# Altium schematic sheet USB2517.SchDoc
size A3
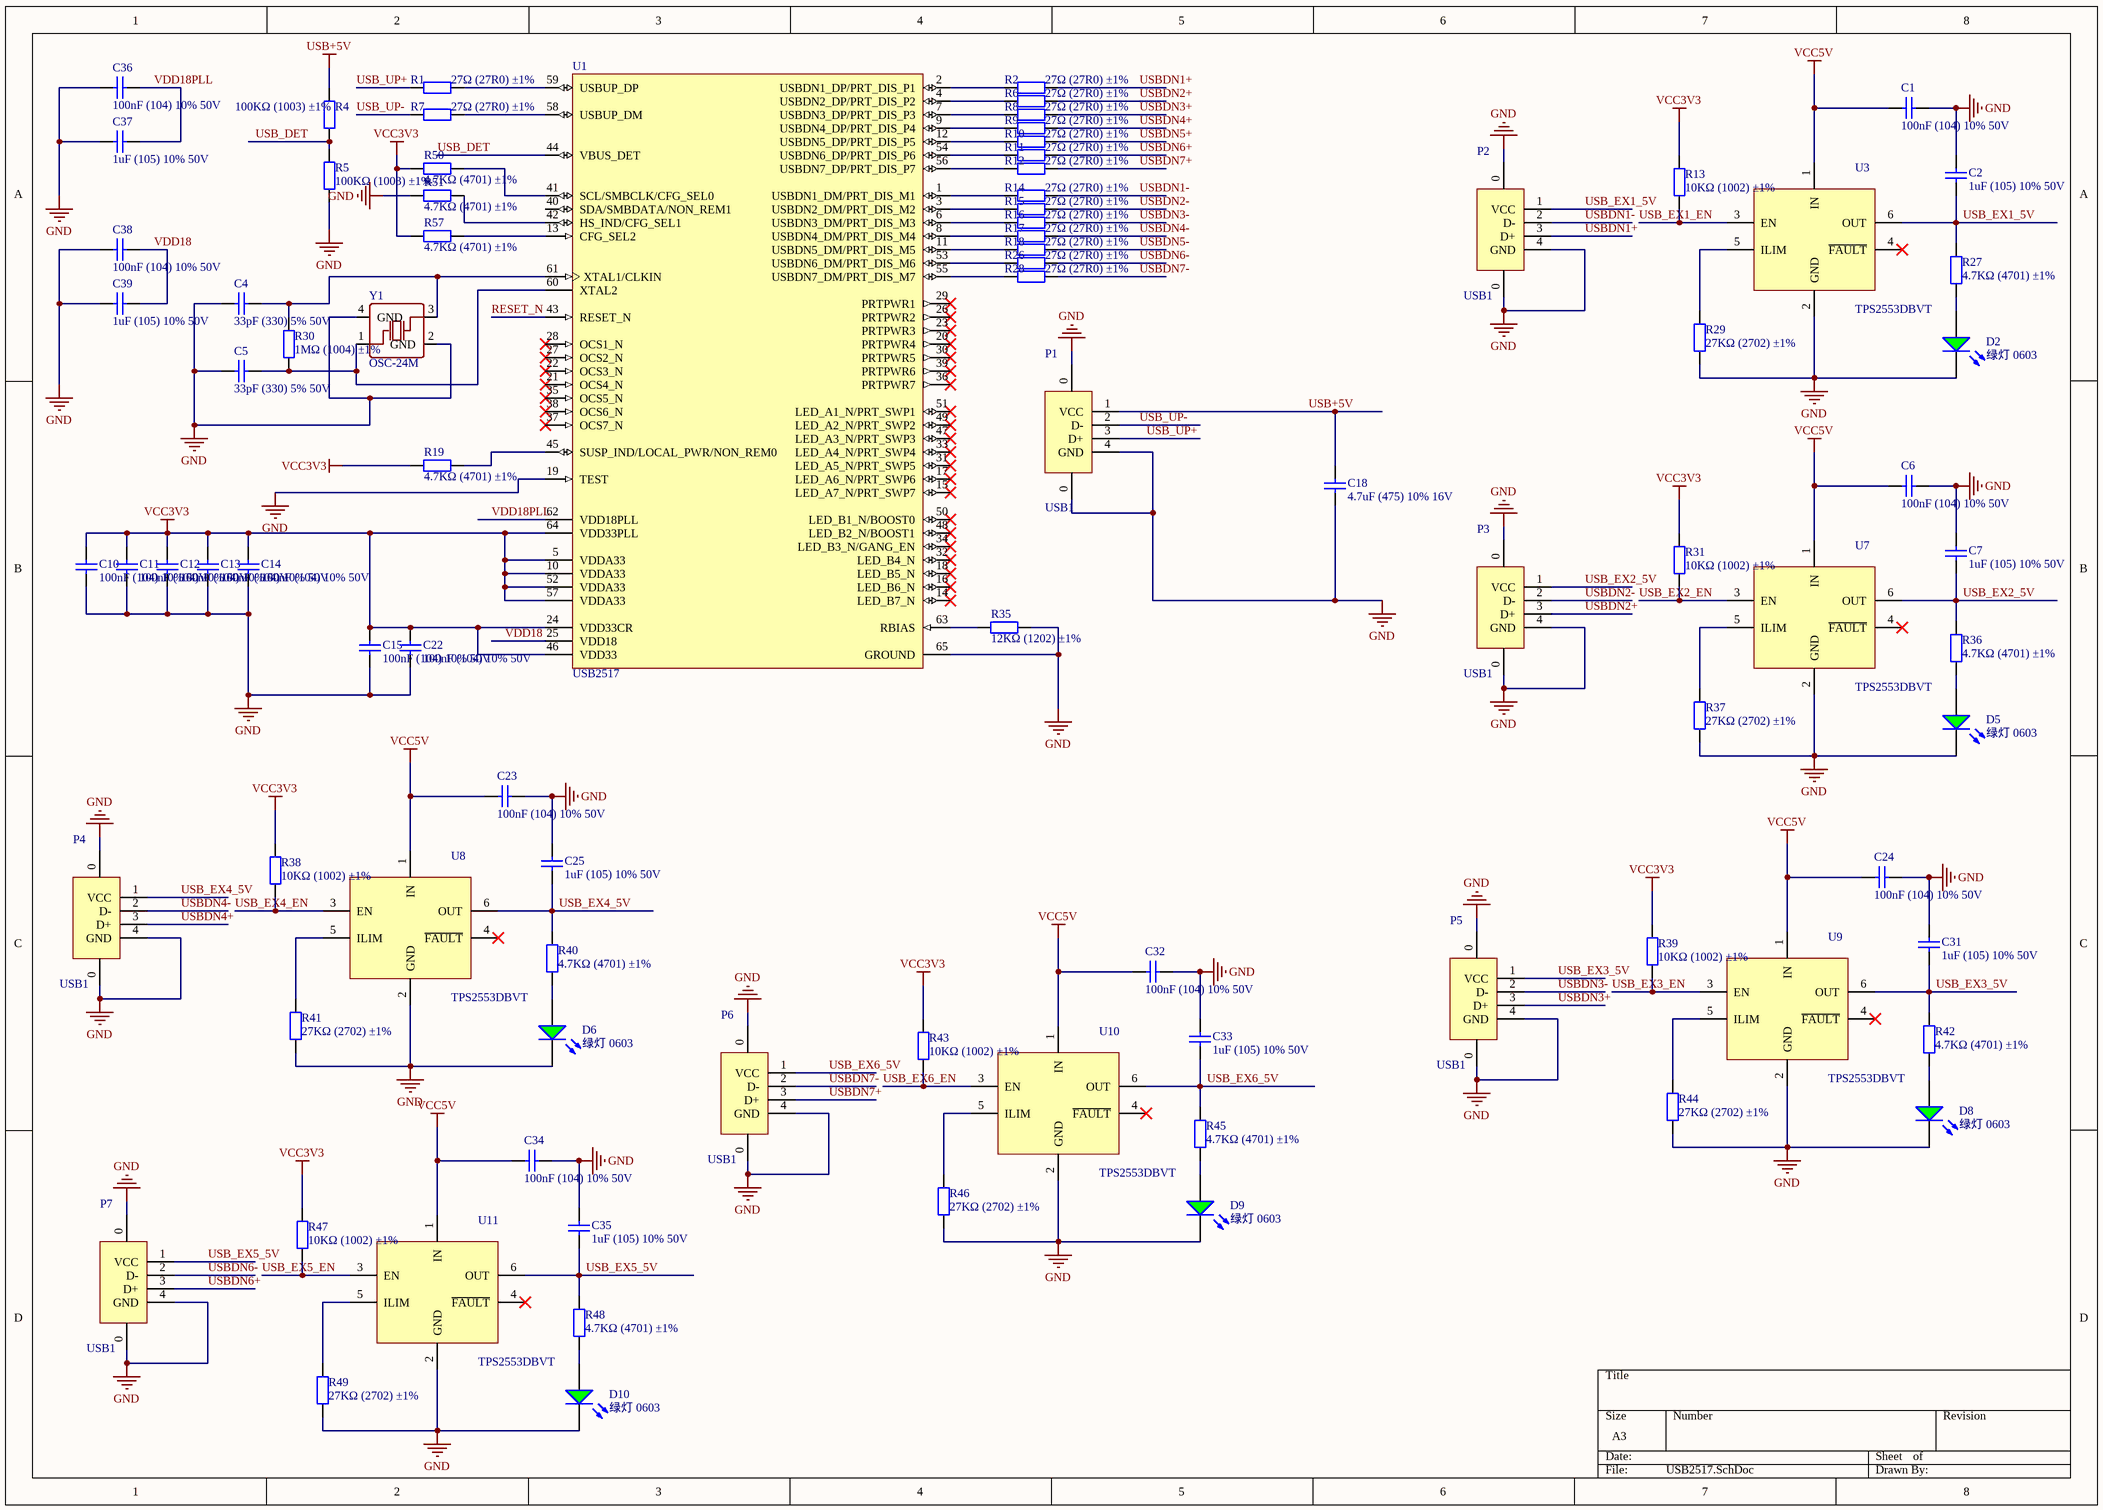
[diagram p0: USB2517.SchDoc]

## Parts
C1  100nF (104) 10% 50V  [0603_C]
C2  1uF (105) 10% 50V  [0603_C]
C4  33pF (330) 5% 50V  [0603_C]
C5  33pF (330) 5% 50V  [0603_C]
C6  100nF (104) 10% 50V  [0603_C]
C7  1uF (105) 10% 50V  [0603_C]
C10  100nF (104) 10% 50V  [0603_C]
C11  100nF (104) 10% 50V  [0603_C]
C12  100nF (104) 10% 50V  [0603_C]
C13  100nF (104) 10% 50V  [0603_C]
C14  100nF (104) 10% 50V  [0603_C]
C15  100nF (104) 10% 50V  [0603_C]
C18  4.7uF (475) 10% 16V  [0603_C]
C22  100nF (104) 10% 50V  [0603_C]
C23  100nF (104) 10% 50V  [0603_C]
C24  100nF (104) 10% 50V  [0603_C]
C25  1uF (105) 10% 50V  [0603_C]
C31  1uF (105) 10% 50V  [0603_C]
C32  100nF (104) 10% 50V  [0603_C]
C33  1uF (105) 10% 50V  [0603_C]
C34  100nF (104) 10% 50V  [0603_C]
C35  1uF (105) 10% 50V  [0603_C]
C36  100nF (104) 10% 50V  [0603_C]
C37  1uF (105) 10% 50V  [0603_C]
C38  100nF (104) 10% 50V  [0603_C]
C39  1uF (105) 10% 50V  [0603_C]
D2  绿灯 0603  [0603_LED_S1]
D5  绿灯 0603  [0603_LED_S1]
D6  绿灯 0603  [0603_LED_S1]
D8  绿灯 0603  [0603_LED_S1]
D9  绿灯 0603  [0603_LED_S1]
D10  绿灯 0603  [0603_LED_S1]
P1  USB1  [USB-B-TH_USB-B01]
P2  USB1  [USB-A-TH_AF90-OFFSET - duplicate]
P3  USB1  [USB-A-TH_AF90-OFFSET - duplicate]
P4  USB1  [USB-A-TH_AF90-OFFSET - duplicate]
P5  USB1  [USB-A-TH_AF90-OFFSET - duplicate]
P6  USB1  [USB-A-TH_AF90-OFFSET - duplicate]
P7  USB1  [USB-A-TH_AF90-OFFSET - duplicate]
R1  27Ω (27R0) ±1%  [0603_R]
R2  27Ω (27R0) ±1%  [0603_R]
R4  100KΩ (1003) ±1%  [0603_R]
R5  100KΩ (1003) ±1%  [0603_R]
R6  27Ω (27R0) ±1%  [0603_R]
R7  27Ω (27R0) ±1%  [0603_R]
R8  27Ω (27R0) ±1%  [0603_R]
R9  27Ω (27R0) ±1%  [0603_R]
R10  27Ω (27R0) ±1%  [0603_R]
R11  27Ω (27R0) ±1%  [0603_R]
R12  27Ω (27R0) ±1%  [0603_R]
R13  10KΩ (1002) ±1%  [0603_R]
R14  27Ω (27R0) ±1%  [0603_R]
R15  27Ω (27R0) ±1%  [0603_R]
R16  27Ω (27R0) ±1%  [0603_R]
R17  27Ω (27R0) ±1%  [0603_R]
R18  27Ω (27R0) ±1%  [0603_R]
R19  4.7KΩ (4701) ±1%  [0603_R]
R26  27Ω (27R0) ±1%  [0603_R]
R27  4.7KΩ (4701) ±1%  [0603_R]
R28  27Ω (27R0) ±1%  [0603_R]
R29  27KΩ (2702) ±1%  [0603_R]
R30  1MΩ (1004) ±1%  [0603_R]
R31  10KΩ (1002) ±1%  [0603_R]
R35  12KΩ (1202) ±1%  [0603_R]
R36  4.7KΩ (4701) ±1%  [0603_R]
R37  27KΩ (2702) ±1%  [0603_R]
R38  10KΩ (1002) ±1%  [0603_R]
R39  10KΩ (1002) ±1%  [0603_R]
R40  4.7KΩ (4701) ±1%  [0603_R]
R41  27KΩ (2702) ±1%  [0603_R]
R42  4.7KΩ (4701) ±1%  [0603_R]
R43  10KΩ (1002) ±1%  [0603_R]
R44  27KΩ (2702) ±1%  [0603_R]
R45  4.7KΩ (4701) ±1%  [0603_R]
R46  27KΩ (2702) ±1%  [0603_R]
R47  10KΩ (1002) ±1%  [0603_R]
R48  4.7KΩ (4701) ±1%  [0603_R]
R49  27KΩ (2702) ±1%  [0603_R]
R50  4.7KΩ (4701) ±1%  [0603_R]
R51  4.7KΩ (4701) ±1%  [0603_R]
R57  4.7KΩ (4701) ±1%  [0603_R]
U1  USB2517  [QFN-64]
U3  TPS2553DBVT  [SOT-23-6]
U7  TPS2553DBVT  [SOT-23-6]
U8  TPS2553DBVT  [SOT-23-6]
U9  TPS2553DBVT  [SOT-23-6]
U10  TPS2553DBVT  [SOT-23-6]
U11  TPS2553DBVT  [SOT-23-6]
Y1  OSC-24M  [SMD-3225_4P]

## Nets
GND: C1.2 C2.2 C4.1 C5.1 C6.2 C7.2 C10.2 C11.1 C12.1 C13.1 C14.1 C15.1 C18.1 C22.1 C23.2 C24.2 C25.2 C31.2 C32.2 C33.2 C34.2 C35.2 C36.1 C37.1 C38.1 C39.1 D2.K D5.K D6.K D8.K D9.K D10.K P1.0 P1.4(GND) P2.0 P2.4(GND) P3.0 P3.4(GND) P4.0 P4.4(GND) P5.0 P5.4(GND) P6.0 P6.4(GND) P7.0 P7.4(GND) R5.1 R29.1 R35.2 R37.1 R41.1 R44.1 R46.1 R49.1 R51.1 U1.19(TEST) U1.65(GROUND) U3.2(GND) U7.2(GND) U8.2(GND) U9.2(GND) U10.2(GND) U11.2(GND) Y1.2(GND) Y1.4(GND)
USB+5V: C18.2 P1.1(VCC) R4.2
VCC3V3: C10.1 C11.2 C12.2 C13.2 C14.2 C15.2 C22.2 R13.2 R19.2 R31.2 R38.2 R39.2 R43.2 R47.2 R50.1 R57.1 U1.5(VDDA33) U1.10(VDDA33) U1.24(VDD33CR) U1.46(VDD33) U1.52(VDDA33) U1.57(VDDA33) U1.64(VDD33PLL)
VCC5V: C1.1 C6.1 C23.1 C24.1 C32.1 C34.1 U3.1(IN) U7.1(IN) U8.1(IN) U9.1(IN) U10.1(IN) U11.1(IN)
RESET_N: U1.43(RESET_N)
USB_DET: R4.1 R5.2 U1.44(VBUS_DET)
USB_EX1_5V: C2.1 P2.1(VCC) R27.2 U3.6(OUT)
USB_EX1_EN: R13.1 U3.3(EN)
USB_EX2_5V: C7.1 P3.1(VCC) R36.2 U7.6(OUT)
USB_EX2_EN: R31.1 U7.3(EN)
USB_EX3_5V: C31.1 P5.1(VCC) R42.2 U9.6(OUT)
USB_EX3_EN: R39.1 U9.3(EN)
USB_EX4_5V: C25.1 P4.1(VCC) R40.2 U8.6(OUT)
USB_EX4_EN: R38.1 U8.3(EN)
USB_EX5_5V: C35.1 P7.1(VCC) R48.2 U11.6(OUT)
USB_EX5_EN: R47.1 U11.3(EN)
USB_EX6_5V: C33.1 P6.1(VCC) R45.2 U10.6(OUT)
USB_EX6_EN: R43.1 U10.3(EN)
USB_UP+: P1.3(D+) R1.1
USB_UP-: P1.2(D-) R7.1
USBDN1+: P2.3(D+) R2.2
USBDN1-: P2.2(D-) R14.2
USBDN2+: P3.3(D+) R6.2
USBDN2-: P3.2(D-) R15.2
USBDN3+: P5.3(D+) R8.2
USBDN3-: P5.2(D-) R16.2
USBDN4+: P4.3(D+) R9.2
USBDN4-: P4.2(D-) R17.2
USBDN5+: R10.2
USBDN5-: R18.2
USBDN6+: P7.3(D+) R11.2
USBDN6-: P7.2(D-) R26.2
USBDN7+: P6.3(D+) R12.2
USBDN7-: P6.2(D-) R28.2
VDD18: C38.2 C39.2 U1.25(VDD18)
VDD18PLL: C36.2 C37.2 U1.62(VDD18PLL)
NetC4_2: C4.2 R30.2 U1.61(XTAL1/CLKIN) Y1.3(OSC2)
NetC5_2: C5.2 R30.1 U1.60(XTAL2) Y1.1(OSC1)
NetD2_A: D2.A R27.1
NetD5_A: D5.A R36.1
NetD6_A: D6.A R40.1
NetD8_A: D8.A R42.1
NetD9_A: D9.A R45.1
NetD10_A: D10.A R48.1
NetR1_2: R1.2 U1.59(USBUP_DP)
NetR2_1: R2.1 U1.2(USBDN1_DP/PRT_DIS_P1)
NetR6_1: R6.1 U1.4(USBDN2_DP/PRT_DIS_P2)
NetR7_2: R7.2 U1.58(USBUP_DM)
NetR8_1: R8.1 U1.7(USBDN3_DP/PRT_DIS_P3)
NetR9_1: R9.1 U1.9(USBDN4_DP/PRT_DIS_P4)
NetR10_1: R10.1 U1.12(USBDN5_DP/PRT_DIS_P5)
NetR11_1: R11.1 U1.54(USBDN6_DP/PRT_DIS_P6)
NetR12_1: R12.1 U1.56(USBDN7_DP/PRT_DIS_P7)
NetR14_1: R14.1 U1.1(USBDN1_DM/PRT_DIS_M1)
NetR15_1: R15.1 U1.3(USBDN2_DM/PRT_DIS_M2)
NetR16_1: R16.1 U1.6(USBDN3_DM/PRT_DIS_M3)
NetR17_1: R17.1 U1.8(USBDN4_DM/PRT_DIS_M4)
NetR18_1: R18.1 U1.11(USBDN5_DM/PRT_DIS_M5)
NetR19_1: R19.1 U1.45(SUSP_IND/LOCAL_PWR/NON_REM0)
NetR26_1: R26.1 U1.53(USBDN6_DM/PRT_DIS_M6)
NetR28_1: R28.1 U1.55(USBDN7_DM/PRT_DIS_M7)
NetR29_2: R29.2 U3.5(ILIM)
NetR35_1: R35.1 U1.63(RBIAS)
NetR37_2: R37.2 U7.5(ILIM)
NetR41_2: R41.2 U8.5(ILIM)
NetR44_2: R44.2 U9.5(ILIM)
NetR46_2: R46.2 U10.5(ILIM)
NetR49_2: R49.2 U11.5(ILIM)
NetR50_2: R50.2 U1.41(SCL/SMBCLK/CFG_SEL0)
NetR51_2: R51.2 U1.42(HS_IND/CFG_SEL1)
NetR57_2: R57.2 U1.13(CFG_SEL2)

Not connected (* = marked no-connect by the designer): U1 14(LED_B7_N)* 15(LED_A7_N/PRT_SWP7)* 16(LED_B6_N)* 17(LED_A6_N/PRT_SWP6)* 18(LED_B5_N)* 20(PRTPWR4)* 21(OCS4_N)* 22(OCS3_N)* 23(PRTPWR3)* 26(PRTPWR2)* 27(OCS2_N)* 28(OCS1_N)* 29(PRTPWR1)* 30(PRTPWR5)* 31(LED_A5_N/PRT_SWP5)* 32(LED_B4_N)* 33(LED_A4_N/PRT_SWP4)* 34(LED_B3_N/GANG_EN)* 35(OCS5_N)* 36(PRTPWR7)* 37(OCS7_N)* 38(OCS6_N)* 39(PRTPWR6)* 40(SDA/SMBDATA/NON_REM1) 47(LED_A3_N/PRT_SWP3)* 48(LED_B2_N/BOOST1)* 49(LED_A2_N/PRT_SWP2)* 50(LED_B1_N/BOOST0)* 51(LED_A1_N/PRT_SWP1)*; U3 4(~{FAULT})*; U7 4(~{FAULT})*; U8 4(~{FAULT})*; U9 4(~{FAULT})*; U10 4(~{FAULT})*; U11 4(~{FAULT})*

## Library data of the parts
C1 C6 C10-C15 C22-C24 C32 C34 C36 C38 = 0603 100nF (104) 10% 50V: 贴片电容; ComponentLink1Description: 供应商链接; ComponentLink1URL: http://www.szlcsc.com/product/details_15331.html; Package: 0603; Supplier: LC; SuppliersPartNumber: C14663
C2 C7 C25 C31 C33 C35 C37 C39 = 0603 1uF (105) 10% 50V: 贴片电容; ComponentLink1Description: 供应商链接; ComponentLink1URL: http://www.szlcsc.com/product/details_16531.html; Package: 0603; Supplier: LC; SuppliersPartNumber: C15849
C4 C5 = 0603 33pF (330) 5% 50V: 贴片电容; ComponentLink1Description: 供应商链接; ComponentLink1URL: http://www.szlcsc.com/product/details_2015.html; Package: 0603; Supplier: LC; SuppliersPartNumber: C1663
C18 = 0603 4.7uF (475) 10% 16V: 贴片电容; ComponentLink1Description: 供应商链接; ComponentLink1URL: http://www.szlcsc.com/product/details_20375.html; Package: 0603; Supplier: LC; SuppliersPartNumber: C19666
D2 D5 D6 D8-D10 = 0603 绿灯: 发光二极管; ComponentLink1Description: 供应商链接; ComponentLink1URL: http://www.szlcsc.com/product/details_73152.html; Package: 0603; Supplier: LC; SuppliersPartNumber: C72043
R1 R2 R6-R12 R14-R18 R26 R28 = 0603 27Ω (27R0) 1%: 贴片电阻; ComponentLink1Description: 供应商链接; ComponentLink1URL: http://www.szlcsc.com/product/details_25933.html; Package: 0603; Supplier: LC; SuppliersPartNumber: C25190
R4 R5 = 0603 100KΩ (1003) 1%: 贴片电阻; ComponentLink1Description: 供应商链接; ComponentLink1URL: http://www.szlcsc.com/product/details_26546.html; Package: 0603; Supplier: LC; SuppliersPartNumber: C25803
R13 R31 R38 R39 R43 R47 = 0603 10KΩ (1002) 1%: 贴片电阻; ComponentLink1Description: 供应商链接; ComponentLink1URL: http://www.szlcsc.com/product/details_26547.html; Package: 0603; Supplier: LC; SuppliersPartNumber: C25804
R19 R27 R36 R40 R42 R45 R48 R50 R51 R57 = 0603 4.7KΩ (4701) 1%: 贴片电阻; ComponentLink1Description: 供应商链接; ComponentLink1URL: http://www.szlcsc.com/product/details_23889.html; Package: 0603; Supplier: LC; SuppliersPartNumber: C23162
R29 R37 R41 R44 R46 R49 = 0603 27KΩ (2702) 1%: 贴片电阻; ComponentLink1Description: 供应商链接; ComponentLink1URL: http://www.szlcsc.com/product/details_23694.html; Package: 0603; Supplier: LC; SuppliersPartNumber: C22967
R30 = 0603 1MΩ (1004) 1%: 贴片电阻; ComponentLink1Description: 供应商链接; ComponentLink1URL: http://www.szlcsc.com/product/details_23662.html; Package: 0603; Supplier: LC; SuppliersPartNumber: C22935
R35 = 0603 12KΩ (1202) 1%: 贴片电阻; ComponentLink1Description: 供应商链接; ComponentLink1URL: http://www.szlcsc.com/product/details_23517.html; Package: 0603; Supplier: LC; SuppliersPartNumber: C22790
U1 = USB2517-JZX
U3 U7-U11 = TPS2553DBVT: SOT-23-6
Y1 = OSC-24M: SMD-3225_4P